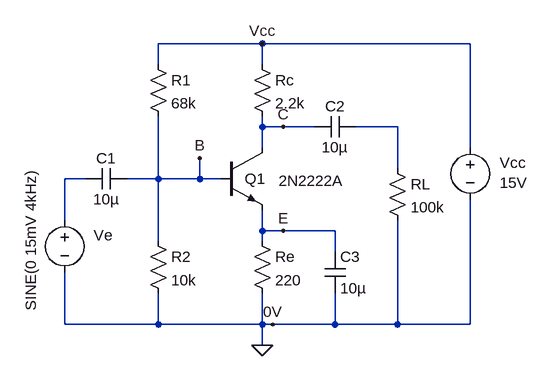
[diagram p0: schematic E7-autopolarizacion.asc]
E7-autopolarizacion.asc, the LTspice schematic file:
Version 4
SHEET 1 916 680
WIRE 32 -64 -128 -64
WIRE 352 -64 32 -64
WIRE -128 -32 -128 -64
WIRE 32 -32 32 -64
WIRE 32 64 32 48
WIRE 64 64 32 64
WIRE 112 64 64 64
WIRE 240 64 176 64
WIRE 32 96 32 64
WIRE 352 96 352 -64
WIRE 240 128 240 64
WIRE -240 144 -272 144
WIRE -128 144 -128 48
WIRE -128 144 -176 144
WIRE -64 144 -64 112
WIRE -64 144 -128 144
WIRE -32 144 -64 144
WIRE -272 208 -272 144
WIRE 32 224 32 192
WIRE 64 224 32 224
WIRE 144 224 64 224
WIRE -128 240 -128 144
WIRE 32 240 32 224
WIRE 144 256 144 224
WIRE -272 368 -272 288
WIRE -128 368 -128 320
WIRE -128 368 -272 368
WIRE 32 368 32 320
WIRE 32 368 -128 368
WIRE 48 368 32 368
WIRE 144 368 144 320
WIRE 144 368 48 368
WIRE 240 368 240 208
WIRE 240 368 144 368
WIRE 352 368 352 176
WIRE 352 368 240 368
WIRE 32 400 32 368
FLAG 64 64 C
FLAG 64 224 E
FLAG -64 112 B
FLAG 32 400 0
FLAG 48 368 0V
FLAG 32 -64 Vcc
SYMBOL npn -32 96 R0
WINDOW 0 37 48 Left 2
WINDOW 3 89 51 Left 2
SYMATTR InstName Q1
SYMATTR Value 2N2222A
SYMBOL voltage 352 80 R0
WINDOW 0 45 39 Left 2
WINDOW 3 45 70 Left 2
WINDOW 123 0 0 Left 0
WINDOW 39 0 0 Left 0
SYMATTR InstName Vcc
SYMATTR Value 15V
SYMBOL res -144 -48 R0
SYMATTR InstName R1
SYMATTR Value 68k
SYMBOL res -144 224 R0
SYMATTR InstName R2
SYMATTR Value 10k
SYMBOL res 16 -48 R0
SYMATTR InstName Rc
SYMATTR Value 2.2k
SYMBOL res 16 224 R0
SYMATTR InstName Re
SYMATTR Value 220
SYMBOL cap 128 256 R0
SYMATTR InstName C3
SYMATTR Value 10µ
SYMBOL cap 176 48 R90
WINDOW 0 0 32 VBottom 2
WINDOW 3 32 32 VTop 2
SYMATTR InstName C2
SYMATTR Value 10µ
SYMBOL cap -176 128 R90
WINDOW 0 0 32 VBottom 2
WINDOW 3 32 32 VTop 2
SYMATTR InstName C1
SYMATTR Value 10µ
SYMBOL voltage -272 192 R0
WINDOW 0 45 39 Left 2
WINDOW 3 -52 -61 VRight 2
WINDOW 123 0 0 Left 0
WINDOW 39 0 0 Left 0
SYMATTR InstName Ve
SYMATTR Value SINE(0 15mV 4kHz)
SYMBOL res 224 112 R0
SYMATTR InstName RL
SYMATTR Value 100k

The netlist it stands for:
* E7-autopolarizacion.asc
Q1 C B E 0 2N2222A
Vcc Vcc 0 15V
R1 Vcc B 68k
R2 B 0 10k
Rc Vcc C 2.2k
Re E 0 220
C3 E 0 10µ
C2 N001 C 10µ
C1 B N002 10µ
Ve N002 0 SINE(0 15mV 4kHz)
RL N001 0 100k
.model NPN NPN
.model PNP PNP
.lib standard.bjt
.backanno
.end